# Altium schematic sheet 野火_STM32F103C8T6_核心板_V1.0_底板原理图参考设计_AD格式.SchDoc
size 297 x 209 mm
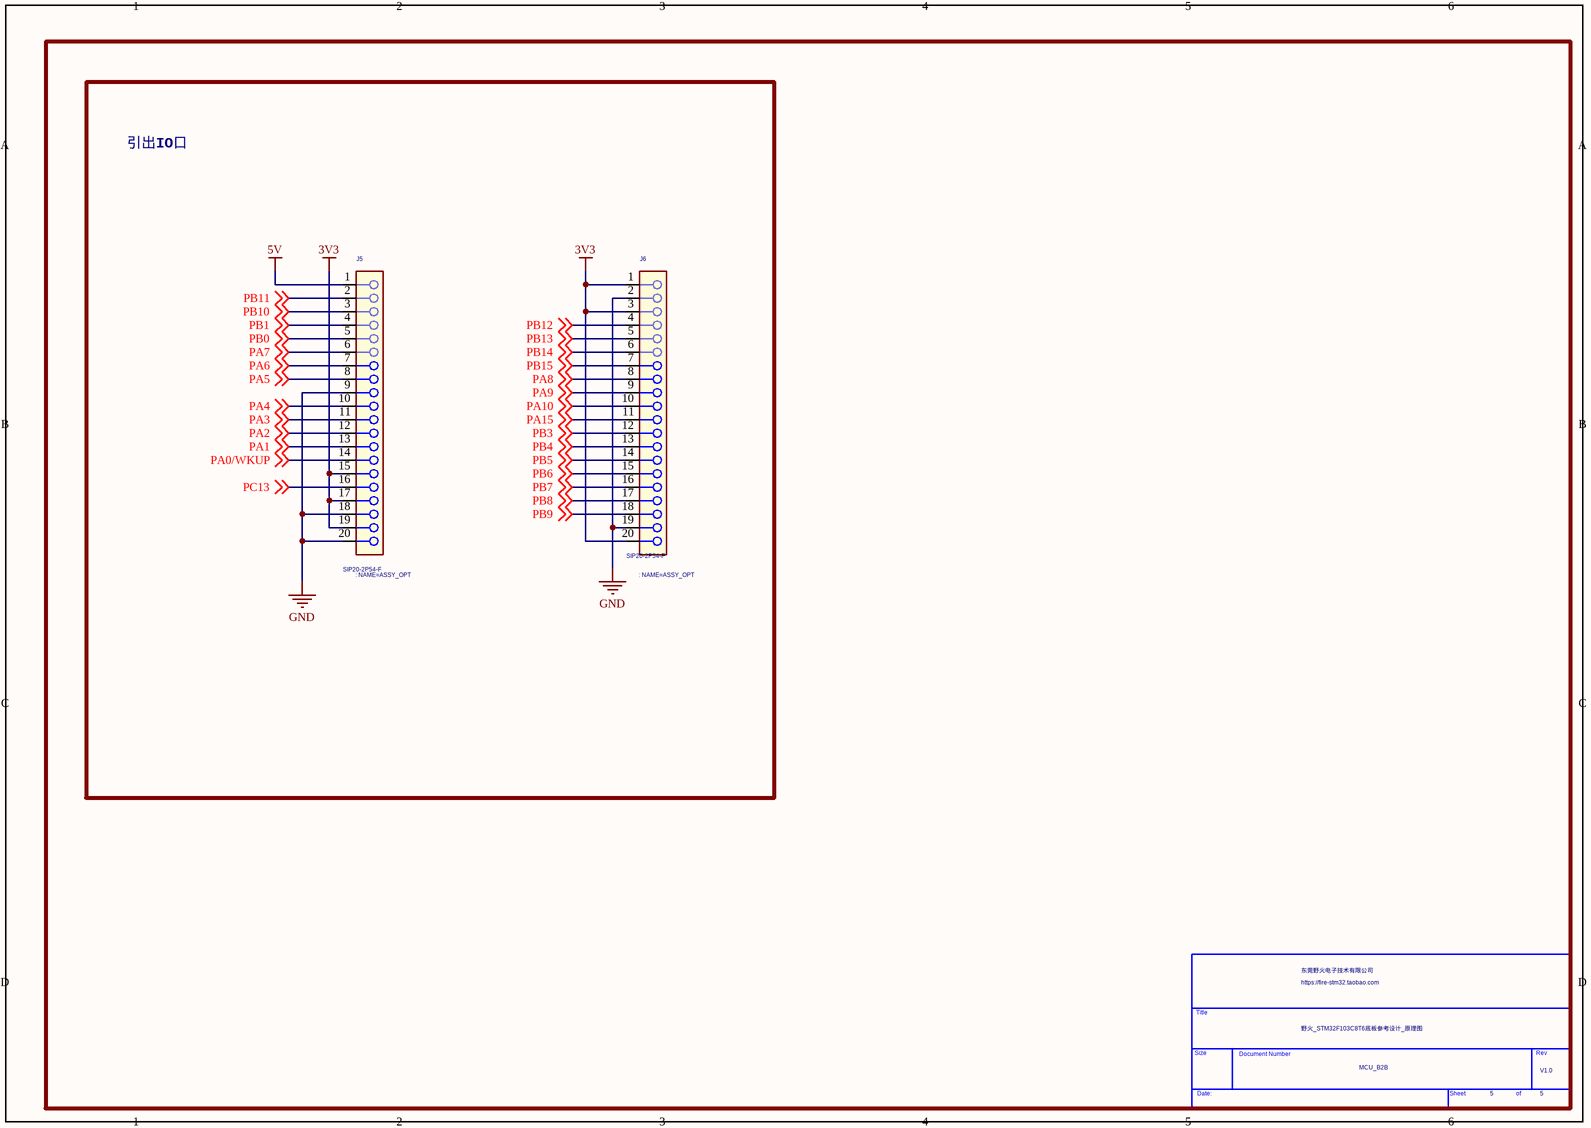
[diagram p0: 野火_STM32F103C8T6_核心板_V1.0_底板原理图参考设计_AD格式.SchDoc]

## Parts
*  Doc: MCU_B2B  RevCode: V1.0  Title: 野火_STM32F103C8T6底板参考设计_原理图  OrgName: 东莞野火电子技术有限公司  Page Number: 5  (hidden comment: TitleBlock_YHSCH)  (graphical)
J5  SIP20-2P54-F  [SIP20-2P54-F]
J6  SIP20-2P54-F  [SIP20-2P54-F]

## Blocks framed on the sheet
引出IO口: J5 J6

## Nets
3V3: J5.15 J5.17 J5.19 J6.1 J6.3 J6.20
5V: J5.1
GND: J5.9 J5.18 J5.20 J6.2 J6.19
PA0/WKUP: J5.14 ; off-sheet PA0/WKUP
PA1: J5.13 ; off-sheet PA1
PA2: J5.12 ; off-sheet PA2
PA3: J5.11 ; off-sheet PA3
PA4: J5.10 ; off-sheet PA4
PA5: J5.8 ; off-sheet PA5
PA6: J5.7 ; off-sheet PA6
PA7: J5.6 ; off-sheet PA7
PA8: J6.8 ; off-sheet PA8
PA9: J6.9 ; off-sheet PA9
PA10: J6.10 ; off-sheet PA10
PA15: J6.11 ; off-sheet PA15
PB0: J5.5 ; off-sheet PB0
PB1: J5.4 ; off-sheet PB1
PB3: J6.12 ; off-sheet PB3
PB4: J6.13 ; off-sheet PB4
PB5: J6.14 ; off-sheet PB5
PB6: J6.15 ; off-sheet PB6
PB7: J6.16 ; off-sheet PB7
PB8: J6.17 ; off-sheet PB8
PB9: J6.18 ; off-sheet PB9
PB10: J5.3 ; off-sheet PB10
PB11: J5.2 ; off-sheet PB11
PB12: J6.4 ; off-sheet PB12
PB13: J6.5 ; off-sheet PB13
PB14: J6.6 ; off-sheet PB14
PB15: J6.7 ; off-sheet PB15
PC13: J5.16 ; off-sheet PC13

## Notes on the sheet
- (in symbol CONN_HDR_1) NAME=ASSY_OPT
- (in symbol TitleBlock_YHSCH) Title; Size; Document Number; Rev; Date:; Sheet; of

## Library data of the parts
* = TitleBlock_YHSCH: Cage Code: 1; OrgAddr1: https://fire-stm32.taobao.com; Page Count: 5
J5 = CONN_HDR_1: CON 1X6 SKT TH 100MIL SP 344H AU 118L; CLASS: IO; CAD_APPROVED: Yes; ASSY_OPT: DNP; Temp_Range: -40°C to +105°C; MFG_PN01: 08001S3 0611-29RF; MFG_NAME01: ANYTRONIC CORPORATION LIMITED; AGILE_PN: 210-81616; HEIGHT: 8.75MM; ROHS: Yes
J6 = CONN_HDR_1: CON 1X6 SKT TH 100MIL SP 344H AU 118L; CLASS: IO; AGILE_PN: 210-81616; MFG_NAME01: ANYTRONIC CORPORATION LIMITED; MFG_PN01: 08001S3 0611-29RF; Temp_Range: -40°C to +105°C; ASSY_OPT: DNP; CAD_APPROVED: Yes; ROHS: Yes; HEIGHT: 8.75MM